# Altium schematic sheet Top_Sheet.SchDoc: Top Sheet
size A4; Revision: 1.0; SheetNumber: 1; SheetTotal: 7
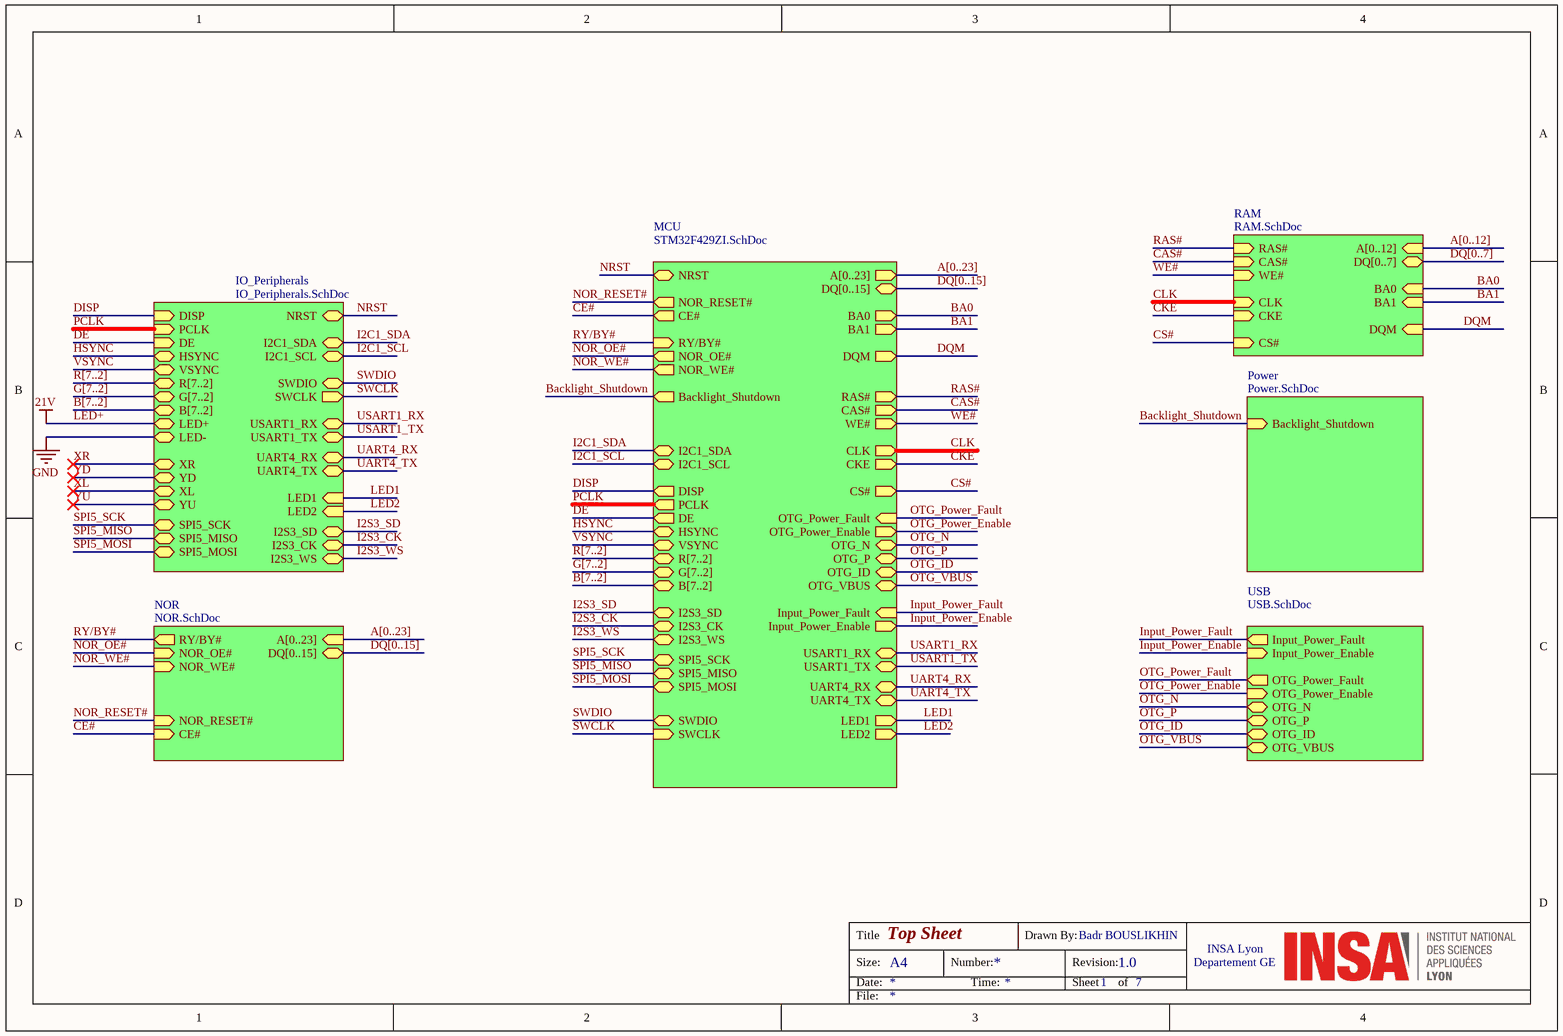
[diagram p0: Top_Sheet.SchDoc]

## Sub-sheets
IO_Peripherals = IO_Peripherals.SchDoc: NRST (bidir), SWDIO (bidir), SWCLK (out), USART1_TX, USART1_RX, DISP (in), PCLK (in), DE (in), HSYNC, VSYNC, R[7..2], G[7..2], B[7..2], LED+, LED-, XR, YD, XL, YU, LED1 (in), LED2 (in), I2C1_SDA, I2C1_SCL, I2S3_SD, I2S3_CK, I2S3_WS, SPI5_SCK, SPI5_MISO, SPI5_MOSI, UART4_RX, UART4_TX
MCU = STM32F429ZI.SchDoc: NRST (bidir), A[0..23] (out), DQ[0..15] (bidir), BA0 (out), BA1 (out), DQM (out), RAS# (out), CAS# (out), WE# (out), CLK (out), CKE (out), CS# (out), NOR_RESET# (out), CE# (out), RY/BY# (in), NOR_OE# (out), NOR_WE# (out), OTG_Power_Fault (in), OTG_Power_Enable (out), OTG_N (bidir), OTG_P (bidir), OTG_ID (bidir), Input_Power_Enable (out), Input_Power_Fault (in), Backlight_Shutdown (out), OTG_VBUS (bidir), DISP (out), PCLK (out), DE (out), HSYNC, VSYNC, R[7..2], G[7..2], B[7..2], SWDIO (bidir), SWCLK (in), USART1_RX, USART1_TX, LED1 (out), LED2 (out), I2C1_SDA, I2C1_SCL, I2S3_SD, I2S3_CK, I2S3_WS, SPI5_SCK, SPI5_MISO, SPI5_MOSI, UART4_RX, UART4_TX
NOR = NOR.SchDoc: A[0..23] (in), DQ[0..15] (bidir), RY/BY# (out), NOR_OE# (in), NOR_WE# (in), NOR_RESET# (in), CE# (in)
Power = Power.SchDoc: Backlight_Shutdown (in)
RAM = RAM.SchDoc: A[0..12] (in), DQ[0..7] (bidir), RAS# (in), CAS# (in), WE# (in), BA0 (in), BA1 (in), CLK (in), CKE (in), CS# (in), DQM (in)
USB = USB.SchDoc: Input_Power_Fault (out), Input_Power_Enable (in), OTG_Power_Fault (out), OTG_Power_Enable (in), OTG_N, OTG_P, OTG_ID, OTG_VBUS

## Nets
GND: sheet IO_Peripherals/LED-
LED+: sheet IO_Peripherals/LED+  [also labelled 21V]
BA0: sheet MCU/BA0, sheet RAM/BA0
BA1: sheet MCU/BA1, sheet RAM/BA1
Backlight_Shutdown: sheet MCU/Backlight_Shutdown, sheet Power/Backlight_Shutdown
CAS#: sheet MCU/CAS#, sheet RAM/CAS#
CE#: sheet MCU/CE#, sheet NOR/CE#
CKE: sheet MCU/CKE, sheet RAM/CKE
CLK: sheet MCU/CLK, sheet RAM/CLK
CS#: sheet MCU/CS#, sheet RAM/CS#
DE: sheet MCU/DE, sheet IO_Peripherals/DE
DISP: sheet MCU/DISP, sheet IO_Peripherals/DISP
DQM: sheet MCU/DQM, sheet RAM/DQM
HSYNC: sheet MCU/HSYNC, sheet IO_Peripherals/HSYNC
I2C1_SCL: sheet MCU/I2C1_SCL, sheet IO_Peripherals/I2C1_SCL
I2C1_SDA: sheet MCU/I2C1_SDA, sheet IO_Peripherals/I2C1_SDA
I2S3_CK: sheet MCU/I2S3_CK, sheet IO_Peripherals/I2S3_CK
I2S3_SD: sheet MCU/I2S3_SD, sheet IO_Peripherals/I2S3_SD
I2S3_WS: sheet MCU/I2S3_WS, sheet IO_Peripherals/I2S3_WS
Input_Power_Enable: sheet MCU/Input_Power_Enable, sheet USB/Input_Power_Enable
Input_Power_Fault: sheet MCU/Input_Power_Fault, sheet USB/Input_Power_Fault
LED1: sheet MCU/LED1, sheet IO_Peripherals/LED1
LED2: sheet MCU/LED2, sheet IO_Peripherals/LED2
NOR_OE#: sheet MCU/NOR_OE#, sheet NOR/NOR_OE#
NOR_RESET#: sheet MCU/NOR_RESET#, sheet NOR/NOR_RESET#
NOR_WE#: sheet MCU/NOR_WE#, sheet NOR/NOR_WE#
NRST: sheet MCU/NRST, sheet IO_Peripherals/NRST
OTG_ID: sheet MCU/OTG_ID, sheet USB/OTG_ID
OTG_N: sheet MCU/OTG_N, sheet USB/OTG_N
OTG_P: sheet MCU/OTG_P, sheet USB/OTG_P
OTG_Power_Enable: sheet MCU/OTG_Power_Enable, sheet USB/OTG_Power_Enable
OTG_Power_Fault: sheet MCU/OTG_Power_Fault, sheet USB/OTG_Power_Fault
OTG_VBUS: sheet MCU/OTG_VBUS, sheet USB/OTG_VBUS
PCLK: sheet MCU/PCLK, sheet IO_Peripherals/PCLK
RAS#: sheet MCU/RAS#, sheet RAM/RAS#
RY/BY#: sheet MCU/RY/BY#, sheet NOR/RY/BY#
SPI5_MISO: sheet MCU/SPI5_MISO, sheet IO_Peripherals/SPI5_MISO
SPI5_MOSI: sheet MCU/SPI5_MOSI, sheet IO_Peripherals/SPI5_MOSI
SPI5_SCK: sheet MCU/SPI5_SCK, sheet IO_Peripherals/SPI5_SCK
SWCLK: sheet MCU/SWCLK, sheet IO_Peripherals/SWCLK
SWDIO: sheet MCU/SWDIO, sheet IO_Peripherals/SWDIO
UART4_RX: sheet MCU/UART4_RX, sheet IO_Peripherals/UART4_RX
UART4_TX: sheet MCU/UART4_TX, sheet IO_Peripherals/UART4_TX
USART1_RX: sheet MCU/USART1_RX, sheet IO_Peripherals/USART1_RX
USART1_TX: sheet MCU/USART1_TX, sheet IO_Peripherals/USART1_TX
VSYNC: sheet MCU/VSYNC, sheet IO_Peripherals/VSYNC
WE#: sheet MCU/WE#, sheet RAM/WE#
XL: sheet IO_Peripherals/XL
XR: sheet IO_Peripherals/XR
YD: sheet IO_Peripherals/YD
YU: sheet IO_Peripherals/YU

## Buses and harness runs
bus A[0..12] = sheet RAM/A[0..12]
bus A[0..23] = sheet MCU/A[0..23]
bus A[0..23] = sheet NOR/A[0..23]
bus B[7..2] = sheet IO_Peripherals/B[7..2]
bus B[7..2] = sheet MCU/B[7..2]
bus DQ[0..7] = sheet RAM/DQ[0..7]
bus DQ[0..15] = sheet MCU/DQ[0..15]
bus DQ[0..15] = sheet NOR/DQ[0..15]
bus G[7..2] = sheet IO_Peripherals/G[7..2]
bus G[7..2] = sheet MCU/G[7..2]
bus R[7..2] = sheet IO_Peripherals/R[7..2]
bus R[7..2] = sheet MCU/R[7..2]

## Notes on the sheet
- Title
- Size:
- Date:
- A4
- Number:
- Time:
- Drawn By:
- Revision:
- Sheet
- Badr BOUSLIKHIN
- of
- Departement GE
- INSA Lyon
- File: